# EAGLE schematic MagicShifter (EAGLE 5.11)
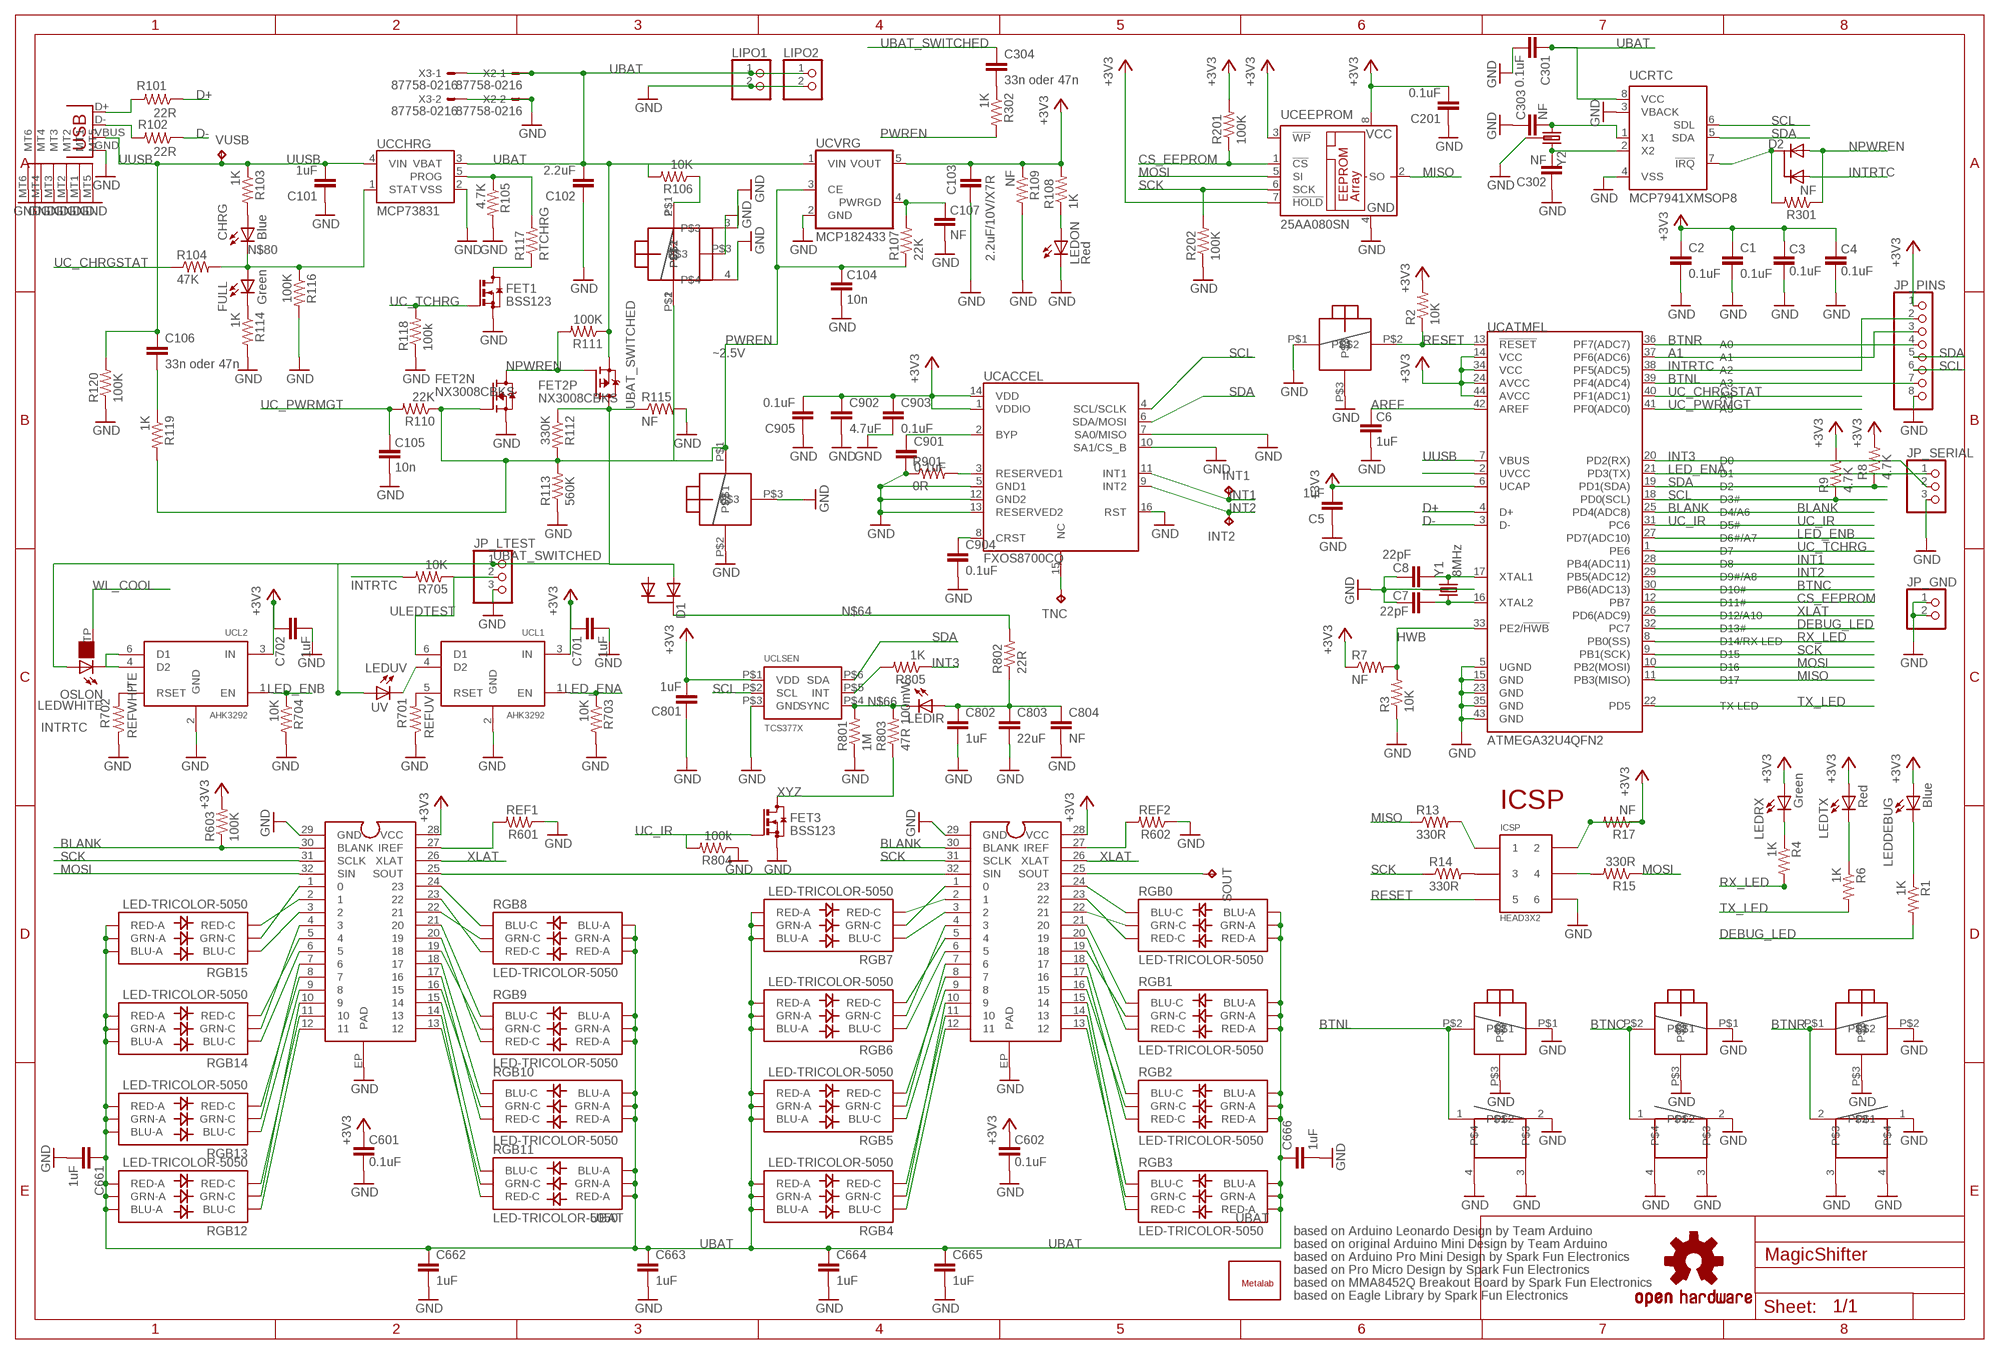
[diagram p0: schematic, sheet 1]

## Parts
BCENT  BUTTON  [B3F-31XX]
BCENT2  B3UBOSS  [B3U-1100P-B]
BLEFT  BUTTON  [B3F-31XX]
BLEFT2  B3UBOSS  [B3U-1100P-B]
BOFF  OFF  B3UNOBOSS  [B3U-1100P]
BON  BUTTON  [B3F-31XX]
BON2  ON  B3UBOSS  [B3U-1100P-B]
BRESET  B3UBOSS  [B3U-1100P-B]
BRIGHT  BUTTON  [B3F-31XX]
BRIGHT2  B3UBOSS  [B3U-1100P-B]
C1  0.1uF  CAP0603-CAP  [0603-CAP]
C2  0.1uF  CAP0603-CAP  [0603-CAP]
C3  0.1uF  CAP0603-CAP  [0603-CAP]
C4  0.1uF  CAP0603-CAP  [0603-CAP]
C5  1uF  CAP0603-CAP  [0603-CAP]
C6  1uF  CAP0603-CAP  [0603-CAP]
C7  22pF  CAP0603-CAP  [0603-CAP]
C8  22pF  CAP0603-CAP  [0603-CAP]
C101  1uF  CAP0603-CAP  [0603-CAP]
C102  2.2uF  CAP0805  [0805]
C103  2.2uF/10V/X7R  CAP0805  [0805]
C104  10n  CAP0603-CAP  [0603-CAP]
C105  10n  CAP0603-CAP  [0603-CAP]
C106  33n oder 47n  CAP0603-CAP  [0603-CAP]
C107  NF  CAP0603-CAP  [0603-CAP]
C201  0.1uF  CAP0603-CAP  [0603-CAP]
C301  0.1uF  CAP0603-CAP  [0603-CAP]
C302  NF  CAP0603-CAP  [0603-CAP]
C303  NF  CAP0603-CAP  [0603-CAP]
C304  33n oder 47n  CAP0603-CAP  [0603-CAP]
C601  0.1uF  CAP0603-CAP  [0603-CAP]
C602  0.1uF  CAP0603-CAP  [0603-CAP]
C661  1uF  CAP0603-CAP  [0603-CAP]
C662  1uF  CAP0603-CAP  [0603-CAP]
C663  1uF  CAP0603-CAP  [0603-CAP]
C664  1uF  CAP0603-CAP  [0603-CAP]
C665  1uF  CAP0603-CAP  [0603-CAP]
C666  1uF  CAP0603-CAP  [0603-CAP]
C701  1uF  CAP0603-CAP  [0603-CAP]
C702  1uF  CAP0603-CAP  [0603-CAP]
C801  1uF  CAP0603-CAP  [0603-CAP]
C802  1uF  CAP0603-CAP  [0603-CAP]
C803  22uF  CAP0805  [0805]
C804  NF  CAP0805  [0805]
C901  0.1uF  CAP0603-CAP  [0603-CAP]
C902  4.7uF  CAP0805  [0805]
C903  0.1uF  CAP0603-CAP  [0603-CAP]
C904  0.1uF  CAP0603-CAP  [0603-CAP]
C905  0.1uF  CAP0603-CAP  [0603-CAP]
CHRG  Blue  LED0603  [LED-0603]
D1  DIODESOT23  [SOT23-3]
D2  DIODESOT23  [SOT23-3]
FET1  BSS123  [SOT23]
FET2  NX3008CBKS  [SOT363_INFINEON]
FET3  BSS123  [SOT23]
FULL  Green  LED0603  [LED-0603]
ICSP  HEAD3X2  [HEAD3X2]
INT1  TPTP07R  [TP07R]
INT2  TPTP07R  [TP07R]
JP_GND  PINHD-1X2_2.54  [1X02]
JP_LTEST  PINHD-1X3_2.54  [1X03]
JP_PINS  PINHD-1X8_2.54  [1X08]
JP_SERIAL  PINHD-1X3_2.54-SMD-90°  [1X03SMD/90]
LEDDEBUG  Blue  LED0603  [LED-0603]
LEDIR  IR  LED1206  [LED-1206]
LEDON  Red  LED0603  [LED-0603]
LEDRX  Green  LED0603  [LED-0603]
LEDTX  Red  LED0603  [LED-0603]
LEDUV  UV  LED1206  [LED-1206]
LEDWHITE  OSLON  [OSLON]
LIPO1  PINHD-1X2_2.54  [1X02]
LIPO2  PINHD-1X2_2.54  [1X02]
R1  1K  RESISTOR0603-RES  [0603-RES]
R2  10K  RESISTOR0603-RES  [0603-RES]
R3  10K  RESISTOR0603-RES  [0603-RES]
R4  1K  RESISTOR0603-RES  [0603-RES]
R6  1K  RESISTOR0603-RES  [0603-RES]
R7  NF  RESISTOR0603-RES  [0603-RES]
R8  4.7K  RESISTOR0603-RES  [0603-RES]
R9  4.7K  RESISTOR0603-RES  [0603-RES]
R13  330R  RESISTOR0603-RES  [0603-RES]
R14  330R  RESISTOR0603-RES  [0603-RES]
R15  330R  RESISTOR0603-RES  [0603-RES]
R17  NF  RESISTOR0603-RES  [0603-RES]
R101  22R  RESISTOR0603-RES  [0603-RES]
R102  22R  RESISTOR0603-RES  [0603-RES]
R103  1K  RESISTOR0603-RES  [0603-RES]
R104  47K  RESISTOR0603-RES  [0603-RES]
R105  4.7K  RESISTOR0603-RES  [0603-RES]
R106  10K  RESISTOR0603-RES  [0603-RES]
R107  22K  RESISTOR0603-RES  [0603-RES]
R108  1K  RESISTOR0603-RES  [0603-RES]
R109  NF  RESISTOR0603-RES  [0603-RES]
R110  22K  RESISTOR0603-RES  [0603-RES]
R111  100K  RESISTOR0603-RES  [0603-RES]
R112  330K  RESISTOR0603-RES  [0603-RES]
R113  560K  RESISTOR0603-RES  [0603-RES]
R114  1K  RESISTOR0603-RES  [0603-RES]
R115  NF  RESISTOR0603-RES  [0603-RES]
R116  100K  RESISTOR0603-RES  [0603-RES]
R117  RTCHRG  RESISTOR0603-RES  [0603-RES]
R118  100k  RESISTOR0603-RES  [0603-RES]
R119  1K  RESISTOR0603-RES  [0603-RES]
R120  100K  RESISTOR0603-RES  [0603-RES]
R201  100K  RESISTOR0603-RES  [0603-RES]
R202  100K  RESISTOR0603-RES  [0603-RES]
R301  NF  RESISTOR0603-RES  [0603-RES]
R302  1K  RESISTOR0603-RES  [0603-RES]
R601  REF1  RESISTOR0603-RES  [0603-RES]
R602  REF2  RESISTOR0603-RES  [0603-RES]
R603  100K  RESISTOR0603-RES  [0603-RES]
R701  REFUV  RESISTOR0603-RES  [0603-RES]
R702  REFWHITE  RESISTOR0603-RES  [0603-RES]
R703  10K  RESISTOR0603-RES  [0603-RES]
R704  10K  RESISTOR0603-RES  [0603-RES]
R705  10K  RESISTOR0603-RES  [0603-RES]
R801  1M  RESISTOR0603-RES  [0603-RES]
R802  22R  RESISTOR0603-RES  [0603-RES]
R803  47R 100mW  RESISTOR0603-RES  [0603-RES]
R804  100k  RESISTOR0603-RES  [0603-RES]
R805  1K  RESISTOR0603-RES  [0603-RES]
R901  0R  RESISTOR0603-RES  [0603-RES]
RGB0  LED-TRICOLOR-5050  [LED-TRICOLOR-5050]
RGB1  LED-TRICOLOR-5050  [LED-TRICOLOR-5050]
RGB2  LED-TRICOLOR-5050  [LED-TRICOLOR-5050]
RGB3  LED-TRICOLOR-5050  [LED-TRICOLOR-5050]
RGB4  LED-TRICOLOR-5050  [LED-TRICOLOR-5050]
RGB5  LED-TRICOLOR-5050  [LED-TRICOLOR-5050]
RGB6  LED-TRICOLOR-5050  [LED-TRICOLOR-5050]
RGB7  LED-TRICOLOR-5050  [LED-TRICOLOR-5050]
RGB8  LED-TRICOLOR-5050  [LED-TRICOLOR-5050]
RGB9  LED-TRICOLOR-5050  [LED-TRICOLOR-5050]
RGB10  LED-TRICOLOR-5050  [LED-TRICOLOR-5050]
RGB11  LED-TRICOLOR-5050  [LED-TRICOLOR-5050]
RGB12  LED-TRICOLOR-5050  [LED-TRICOLOR-5050]
RGB13  LED-TRICOLOR-5050  [LED-TRICOLOR-5050]
RGB14  LED-TRICOLOR-5050  [LED-TRICOLOR-5050]
RGB15  LED-TRICOLOR-5050  [LED-TRICOLOR-5050]
SOUT  TPTP08R  [TP08R]
TNC  TPTP07R  [TP07R]
U$1  OSHW-LOGOS  [OSHW-LOGO-S]
U$2  METALAB  [METALAB]
UCACCEL  FXOS8700CQ  [QFN-16_0.5MM]
UCATMEL  ATMEGA32U4QFN2  [QFN-44-NOPAD]
UCCHRG  MCP73831  [SOT23-5]
UCEEPROM  25AA080SN  [SO-08]
UCL1  AHK3292  [SOT23-6]
UCL2  AHK3292  [SOT23-6]
UCLSEN  TCS377X  [TCS377X]
UCRGB1  TLC5947  [QFN32_VSTOP]
UCRGB2  TLC5947  [QFN32_VSTOP]
UCRTC  MCP7941XMSOP8  [MSOP8]
UCVRG  MCP182433  [SOT25]
VUSB  TPTP10R  [TP10R]
X2  87758-0216  [87758-0216]
X3  87758-0216  [87758-0216]
XUSB  USB-MICROB  [USB-MICROB]
Y1  8MHz  CRYSTAL5X3  [CRYSTAL-SMD-5X3]
Y2  CRYSTAL  [NC15LF]

## Nets
+3V3: C1.1 C2.1 C3.2 C4.2 C5.2 C103.2 C201.2 C601.2 C602.2 C701.1 C702.1 C801.1 C902.1 C903.1 C905.2 ICSP.2 JP_PINS.1 LEDDEBUG.A LEDRX.A LEDTX.A R2.2 R7.1 R8.2 R9.2 R17.1 R17.2 R108.2 R109.1 R201.2 R603.2 UCACCEL.1(VDDIO) UCACCEL.14(VDD) UCATMEL.6(UCAP) UCATMEL.14(VCC) UCATMEL.24(AVCC) UCATMEL.34(VCC) UCATMEL.44(AVCC) UCEEPROM.3(!WP) UCEEPROM.7(!HOLD) UCEEPROM.8(VCC) UCL1.3(IN) UCL2.3(IN) UCLSEN.P$1(VDD) UCRGB1.28(VCC) UCRGB2.28(VCC) UCVRG.5(VOUT)
A1: JP_PINS.3 UCATMEL.37(PF6(ADC6))
AREF: C6.2 UCATMEL.42(AREF)
BLANK: R603.1 UCATMEL.25(PD4(ADC8)) UCRGB1.30(BLANK) UCRGB2.30(BLANK)
BTNC: BCENT2.P$2 BCENT.1 UCATMEL.30(PB6(ADC13))
BTNL: BLEFT2.P$2 BLEFT.1 JP_PINS.7 UCATMEL.39(PF4(ADC4))
BTNR: BRIGHT2.P$1 BRIGHT.2 JP_PINS.4 UCATMEL.36(PF7(ADC7))
CS_EEPROM: R201.1 UCATMEL.12(PB7) UCEEPROM.1(!CS)
D+: R101.1 UCATMEL.4(D+)
D-: R102.1 UCATMEL.3(D-)
DEBUG_LED: R1.2 UCATMEL.32(PC7)
GND [vcc]: BCENT2.P$1 BCENT2.P$3 BCENT.2 BCENT.3 BCENT.4 BLEFT2.P$1 BLEFT2.P$3 BLEFT.2 BLEFT.3 BLEFT.4 BOFF.P$2 BOFF.P$3 BON2.P$3 BON.3 BON.4 BRESET.P$1 BRESET.P$3 BRIGHT2.P$2 BRIGHT2.P$3 BRIGHT.1 BRIGHT.3 BRIGHT.4 C1.2 C2.2 C3.1 C4.1 C5.1 C6.1 C7.2 C8.2 C101.1 C102.1 C103.1 C104.1 C105.1 C107.1 C201.1 C301.2 C302.2 C303.2 C601.1 C602.1 C661.2 C662.2 C663.2 C664.2 C665.2 C666.2 C701.2 C702.2 C801.2 C802.2 C803.2 C804.2 C901.2 C902.2 C903.2 C904.2 C905.1 FET1.2(S) FET2.1(N:S) FET3.2(S) ICSP.6 JP_GND.1 JP_GND.2 JP_LTEST.3 JP_PINS.8 JP_SERIAL.3 LEDON.C LIPO1.2 LIPO2.2 R3.1 R105.2 R109.2 R113.1 R114.2 R115.2 R116.2 R118.1 R120.1 R202.1 R601.1 R602.1 R701.1 R702.1 R703.2 R704.2 R801.1 R804.1 R901.1 UCACCEL.5(GND1) UCACCEL.7(SA0/MISO) UCACCEL.10(SA1/CS_B) UCACCEL.12(GND2) UCACCEL.13(RESERVED2) UCACCEL.16(RST) UCATMEL.5(UGND) UCATMEL.15(GND) UCATMEL.23(GND) UCATMEL.35(GND) UCATMEL.43(GND) UCCHRG.2(VSS) UCEEPROM.4(GND) UCL1.2(GND) UCL2.2(GND) UCLSEN.P$3(GND) UCRGB1.29(GND) UCRGB1.EP(PAD) UCRGB2.29(GND) UCRGB2.EP(PAD) UCRTC.3(VBACK) UCRTC.4(VSS) UCVRG.2(GND) X2.2 X3.2 XUSB.GND XUSB.MT1 XUSB.MT2 XUSB.MT3 XUSB.MT4 XUSB.MT5 XUSB.MT6 Y1.2 Y1.4 Y2.GND
HWB [vcc]: R3.2 R7.2 UCATMEL.33(PE2/!HWB)
INT1: INT1.TP UCACCEL.11(INT1) UCATMEL.28(PB4(ADC11))
INT2: INT2.TP UCACCEL.9(INT2) UCATMEL.29(PB5(ADC12))
INT3: JP_SERIAL.2 R805.1 UCATMEL.20(PD2(RX))
INTRTC: D2.2(A2) JP_PINS.2 R705.2 UCATMEL.38(PF5(ADC5))
LED_ENA: JP_SERIAL.1 R703.1 UCATMEL.21(PD3(TX)) UCL1.1(EN)
LED_ENB: R704.1 UCATMEL.27(PD7(ADC10)) UCL2.1(EN)
MISO: R13.1 UCATMEL.11(PB3(MISO)) UCEEPROM.2(SO)
MOSI: R15.1 UCATMEL.10(PB2(MOSI)) UCEEPROM.5(SI) UCRGB1.32(SIN)
MOSI_ICSP: ICSP.4 R15.2
N$1: C7.1 UCATMEL.16(XTAL2) Y1.1
N$2: C8.1 UCATMEL.17(XTAL1) Y1.3
N$3: CHRG.A R103.2
N$4: LEDRX.C R4.1
N$5: LEDTX.C R6.1
N$6: R102.2 XUSB.D-
N$7: LEDDEBUG.C R1.1
N$8: R101.2 XUSB.D+
N$9: FULL.C R114.1
N$10: UCATMEL.2(UVCC)
N$11: R105.1 R117.2 UCCHRG.5(PROG)
N$12: RGB5.6(GRN-C) UCRGB2.7
N$13: RGB13.4(BLU-C) UCRGB1.9
N$14: RGB13.5(RED-C) UCRGB1.8
N$15: RGB13.6(GRN-C) UCRGB1.7
N$16: RGB8.4(BLU-C) UCRGB1.24
N$17: RGB8.5(RED-C) UCRGB1.23
N$18: RGB8.6(GRN-C) UCRGB1.22
N$19: RGB14.4(BLU-C) UCRGB1.6
N$20: RGB14.5(RED-C) UCRGB1.5
N$21: RGB14.6(GRN-C) UCRGB1.4
N$22: RGB12.4(BLU-C) UCRGB1.12
N$23: RGB12.5(RED-C) UCRGB1.11
N$24: RGB12.6(GRN-C) UCRGB1.10
N$25: RGB15.4(BLU-C) UCRGB1.3
N$26: RGB15.5(RED-C) UCRGB1.2
N$27: RGB15.6(GRN-C) UCRGB1.1
N$28: RGB9.4(BLU-C) UCRGB1.21
N$29: RGB9.5(RED-C) UCRGB1.20
N$30: RGB9.6(GRN-C) UCRGB1.19
N$31: RGB10.4(BLU-C) UCRGB1.18
N$32: RGB10.5(RED-C) UCRGB1.17
N$33: RGB10.6(GRN-C) UCRGB1.16
N$34: RGB11.4(BLU-C) UCRGB1.15
N$35: RGB11.5(RED-C) UCRGB1.14
N$36: R601.2 UCRGB1.27(IREF)
N$37: RGB11.6(GRN-C) UCRGB1.13
N$38: LEDON.A R108.1
N$39: RGB2.6(GRN-C) UCRGB2.16
N$40: RGB2.4(BLU-C) UCRGB2.18
N$41: RGB2.5(RED-C) UCRGB2.17
N$42: RGB1.6(GRN-C) UCRGB2.19
N$43: RGB1.4(BLU-C) UCRGB2.21
N$44: RGB1.5(RED-C) UCRGB2.20
N$45: RGB0.6(GRN-C) UCRGB2.22
N$46: RGB0.4(BLU-C) UCRGB2.24
N$47: RGB0.5(RED-C) UCRGB2.23
N$48: RGB4.6(GRN-C) UCRGB2.10
N$49: RGB4.5(RED-C) UCRGB2.11
N$50: RGB4.4(BLU-C) UCRGB2.12
N$51: RGB3.6(GRN-C) UCRGB2.13
N$52: RGB3.4(BLU-C) UCRGB2.15
N$53: RGB3.5(RED-C) UCRGB2.14
N$54: RGB5.5(RED-C) UCRGB2.8
N$55: RGB5.4(BLU-C) UCRGB2.9
N$56: RGB6.6(GRN-C) UCRGB2.4
N$57: RGB6.5(RED-C) UCRGB2.5
N$58: RGB6.4(BLU-C) UCRGB2.6
N$59: RGB7.6(GRN-C) UCRGB2.1
N$60: RGB7.5(RED-C) UCRGB2.2
N$61: RGB7.4(BLU-C) UCRGB2.3
N$62: R602.2 UCRGB2.27(IREF)
N$63 [vcc]: R901.2 UCACCEL.3(RESERVED1)
N$64: D1.3(C) R802.2
N$65: UCRGB1.25(SOUT) UCRGB2.32(SIN)
N$66: LEDIR.C R801.2 R803.2 UCLSEN.P$4(SYNC)
N$67: FET1.3(D) R117.1
N$68: R701.2 UCL1.5(RSET)
N$69: C904.1 UCACCEL.8(CRST)
N$70: R702.2 UCL2.5(RSET)
N$71: BON2.P$1 BON.2 R106.1
N$72: C802.1 C803.1 C804.1 LEDIR.A R802.1
N$73: LEDUV.C UCL1.4(D2)
N$74: C106.2 R119.1
N$75: C304.2 R302.1
N$76: R805.2 UCLSEN.P$5(INT)
N$77: ICSP.3 R14.2
N$78: ICSP.1 R13.2
N$79: LEDWHITE.K(C) UCL2.4(D2) UCL2.6(D1)
N$80: CHRG.C FULL.A R104.2 R116.1 UCCHRG.1(STAT)
N$81: SOUT.TP UCRGB2.25(SOUT)
N$83: D2.3(C) R301.2 UCRTC.7(!IRQ)
N$84: TNC.TP UCACCEL.15(NC)
N$85: C303.1 UCRTC.1(X1) Y2.1
N$86: C901.1 UCACCEL.2(BYP)
N$87: C302.1 UCRTC.2(X2) Y2.2
NPWREN: D2.1(A1) FET2.5(P:G) FET2.6(N:D) R111.2 R301.1
PWREN: BOFF.P$1 BON2.P$2 BON.1 C104.2 FET2.2(N:G) R107.1 R110.1 R112.2 R113.2 R119.2 R302.2 UCVRG.3(CE)
PWRGOOD: C107.2 R107.2 UCVRG.4(PWRGD)
RESET: BRESET.P$2 ICSP.5 R2.1 UCATMEL.13(!RESET)
RX_LED: R4.2 UCATMEL.8(PB0(SS))
SCK: R14.1 R202.2 UCATMEL.9(PB1(SCK)) UCEEPROM.6(SCK) UCRGB1.31(SCLK) UCRGB2.31(SCLK)
SCL: JP_PINS.6 R9.1 UCACCEL.4(SCL/SCLK) UCATMEL.18(PD0(SCL)) UCLSEN.P$2(SCL) UCRTC.6(SDL)
SDA: JP_PINS.5 R8.1 UCACCEL.6(SDA/MOSI) UCATMEL.19(PD1(SDA)) UCLSEN.P$6(SDA) UCRTC.5(SDA)
TX_LED: R6.2 UCATMEL.22(PD5)
UBAT: C102.2 C301.1 C661.1 C662.1 C663.1 C664.1 C665.1 C666.1 FET2.4(P:S) LIPO1.1 LIPO2.1 R106.2 R111.1 RGB0.1(GRN-A) RGB0.2(RED-A) RGB0.3(BLU-A) RGB1.1(GRN-A) RGB1.2(RED-A) RGB1.3(BLU-A) RGB2.1(GRN-A) RGB2.2(RED-A) RGB2.3(BLU-A) RGB3.1(GRN-A) RGB3.2(RED-A) RGB3.3(BLU-A) RGB4.1(GRN-A) RGB4.2(RED-A) RGB4.3(BLU-A) RGB5.1(GRN-A) RGB5.2(RED-A) RGB5.3(BLU-A) RGB6.1(GRN-A) RGB6.2(RED-A) RGB6.3(BLU-A) RGB7.1(GRN-A) RGB7.2(RED-A) RGB7.3(BLU-A) RGB8.1(GRN-A) RGB8.2(RED-A) RGB8.3(BLU-A) RGB9.1(GRN-A) RGB9.2(RED-A) RGB9.3(BLU-A) RGB10.1(GRN-A) RGB10.2(RED-A) RGB10.3(BLU-A) RGB11.1(GRN-A) RGB11.2(RED-A) RGB11.3(BLU-A) RGB12.1(GRN-A) RGB12.2(RED-A) RGB12.3(BLU-A) RGB13.1(GRN-A) RGB13.2(RED-A) RGB13.3(BLU-A) RGB14.1(GRN-A) RGB14.2(RED-A) RGB14.3(BLU-A) RGB15.1(GRN-A) RGB15.2(RED-A) RGB15.3(BLU-A) UCCHRG.3(VBAT) UCRTC.8(VCC) UCVRG.1(VIN) X2.1 X3.1
UBAT_SWITCHED: C304.1 D1.1(A1) FET2.3(P:D) JP_LTEST.1 LEDUV.A LEDWHITE.A R112.1 R115.1
UC_CHRGSTAT: R104.1 UCATMEL.40(PF1(ADC1))
UC_IR: FET3.1(G) R804.2 UCATMEL.31(PC6)
UC_PWRMGT: C105.2 R110.2 UCATMEL.41(PF0(ADC0))
UC_TCHRG: FET1.1(G) R118.2 UCATMEL.1(PE6)
ULEDTEST: JP_LTEST.2 R705.1 UCL1.6(D1)
UUSB: C101.2 C106.1 R103.1 R120.2 UCATMEL.7(VBUS) UCCHRG.4(VIN) VUSB.TP XUSB.VBUS
WL_COOL: LEDWHITE.TP
XLAT: UCATMEL.26(PD6(ADC9)) UCRGB1.26(XLAT) UCRGB2.26(XLAT)
XYZ: FET3.3(D) R803.1
Unconnected: D1.2(A2)

## Notes on the sheet
- ~2.5V
- ICSP
- based on Arduino Leonardo Design by Team Arduino
- based on original Arduino Mini Design by Team Arduino
- based on Arduino Pro Mini Design by Spark Fun Electronics
- based on Pro Micro Design by Spark Fun Electronics
- based on MMA8452Q Breakout Board by Spark Fun Electronics
- based on Eagle Library by Spark Fun Electronics

## Library data of the parts
BCENT BLEFT BON BRIGHT = variouscomponents:BUTTON
BCENT2 BLEFT2 BOFF BON2 BRESET BRIGHT2 = switches_omrom_b3u:B3U
C1-C8 C101-C107 C201 C301-C304 C601 C602 C661-C666 C701 C702 C801-C804 C901-C905 = SparkFun:CAP: Capacitor Standard 0603 ceramic capacitor, and 0.1" leaded capacitor.
CHRG FULL LEDDEBUG LEDIR LEDON LEDRX LEDTX LEDUV = SparkFun:LED: LEDs Standard schematic elements and footprints for 5mm, 3mm, 1206, and 0603 sized LEDs. 5mm - Spark Fun Electronics SKU : COM-00529 (and others)
D1 D2 = bav170:DIODE: Diode These are standard reverse protection diodes and small signal diodes. SMA package can handle up to about 1A. SOD-323 can handle about 200mA. What the SOD-323 package when ordering, there are some mfgs out there that are 5-pin packages.
FET1 FET3 = transistor-small-signal:BSS123: N-CHANNEL MOS FET
FET2 = DUAL_N_P_MOSFET:NX3008CBKS: NX3008CBKS 30 / 30 V, 350 / 200 mA N/P-channel Trench MOSFET Complementary N/P-channel enhancement mode Field-Effect Transistor (FET) in very small SOT363 (SC-88) Surface-Mounted Device (SMD) plastic package using Trench MOSFET technology http://www.nxp.com/documents/data_sheet/NX3008CBKS.pdf
ICSP = MyCON2:HEAD3X2
INT1 INT2 SOUT TNC VUSB = testpad:TP: Test pad
JP_GND LIPO1 LIPO2 = pinhead:PINHD-1X2: PIN HEADER
JP_LTEST JP_SERIAL = pinhead:PINHD-1X3: PIN HEADER
JP_PINS = pinhead:PINHD-1X8: PIN HEADER
LEDWHITE = osram_oslon:OSLON
R1-R4 R6-R9 R13-R15 R17 R101-R120 R201 R202 R301 R302 R601-R603 R701-R705 R801-R805 R901 = SparkFun:RESISTOR: Resistor Basic schematic elements and footprints for 0603, 1206, and PTH resistors.
RGB0 RGB1-RGB15 = SparkFun:LED-TRICOLOR-5050
U$1 = SparkFun:OSHW-LOGO: Open Source Hardware Logo This logo indicates the piece of hardware it is found on incorporates a OSHW license and/or adheres to the definition of open source hardware found here: http://freedomdefined.org/OSHW
U$2 = variouscomponents:METALAB
UCACCEL = freescale_FXOS8700CQ:FXOS8700CQ: FXOS8700CQ: 6-Axis Xtrinsic Sensor with Integrated Linear Accelerometer and Magnetometer http://cache.freescale.com/files/sensors/doc/data_sheet/FXOS8700CQ.pdf pin compatible with MMA8452Q 3-Axis, 12/8-bit Digital Accelerometer Supply Voltage: 1.6-3.6V Range: +/- 2g, 4g, 8g Interface: I2C, 12-bit and 8-bit ODR: 1.56 Hz - 800 Hz Package: QFN-16 http://cache.freescale.com/files/sensors/doc/data_sheet/MMA8452Q.pdf
UCATMEL = atmega32u4:ATMEGA32U4
UCCHRG = SparkFun:MCP73831: Microchip's MCP73831 Miniature single cell, fully integrated Li-Ion, Li-polymer charge management controller http://ww1.microchip.com/downloads/en/DeviceDoc/21984a.pdf
UCEEPROM = microchip:25*: Serial EEPROM 4K/ 8K , SPI bus; MF: MICROCHIP; MPN: 25AA080/SN; OC_FARNELL: 1816072; OC_NEWARK: 92C7351
UCL1 UCL2 = AHK3292:AHK3292
UCLSEN = TAOS_TCS377X:TCS377X
UCRGB1 UCRGB2 = TLC5947:TLC5947
UCRTC = rtc_i2c:MCP7941X: 2-Wire RTC Real Time Clock/Calendar
UCVRG = MCP1824:MCP1824: MCP1824/MCP1824S 300 mA, Low Voltage, Low Quiescent Current LDO Regulator; 3302EOT: T-3302E/OT
X2 X3 = con-molex:87758-0216: 2 Pin - 2mm Dual Row Single Wafer, Vertical T/H HDR Source: http://www.molex.com/pdm_docs/sd/877580616_sd.pdf; MPN: 87758-0216; OC_FARNELL: unknown; OC_NEWARK: 94M1513
XUSB = usb_connector:USB: USB Connectors USB-B-PTH is fully proven SKU : PRT-00139 USB-miniB is fully proven SKU : PRT-00587 USB-A-PCB is untested. USB-A-H is throughly reviewed, but untested. Spark Fun Electronics SKU : PRT-00437 USB-B-SMT is throughly reviewed, but untested. Needs silkscreen touching up. USB-A-S has not been used/tested USB-MB-H has not been used/tested
Y1 = crystal_5x3mm:CRYSTAL: Crystals Various standard crystals. Proven footprints. Spark Fun Electronics SKU : COM-00534
Y2 = rtc_i2c:CRYSTAL: Crystals Various standard crystals. Proven footprints. Spark Fun Electronics SKU : COM-00534

## Net classes
0 default: width 0.152 mm